# EAGLE design femtoUSB_r1.0.0_TQFP (EAGLE 6.5.0)
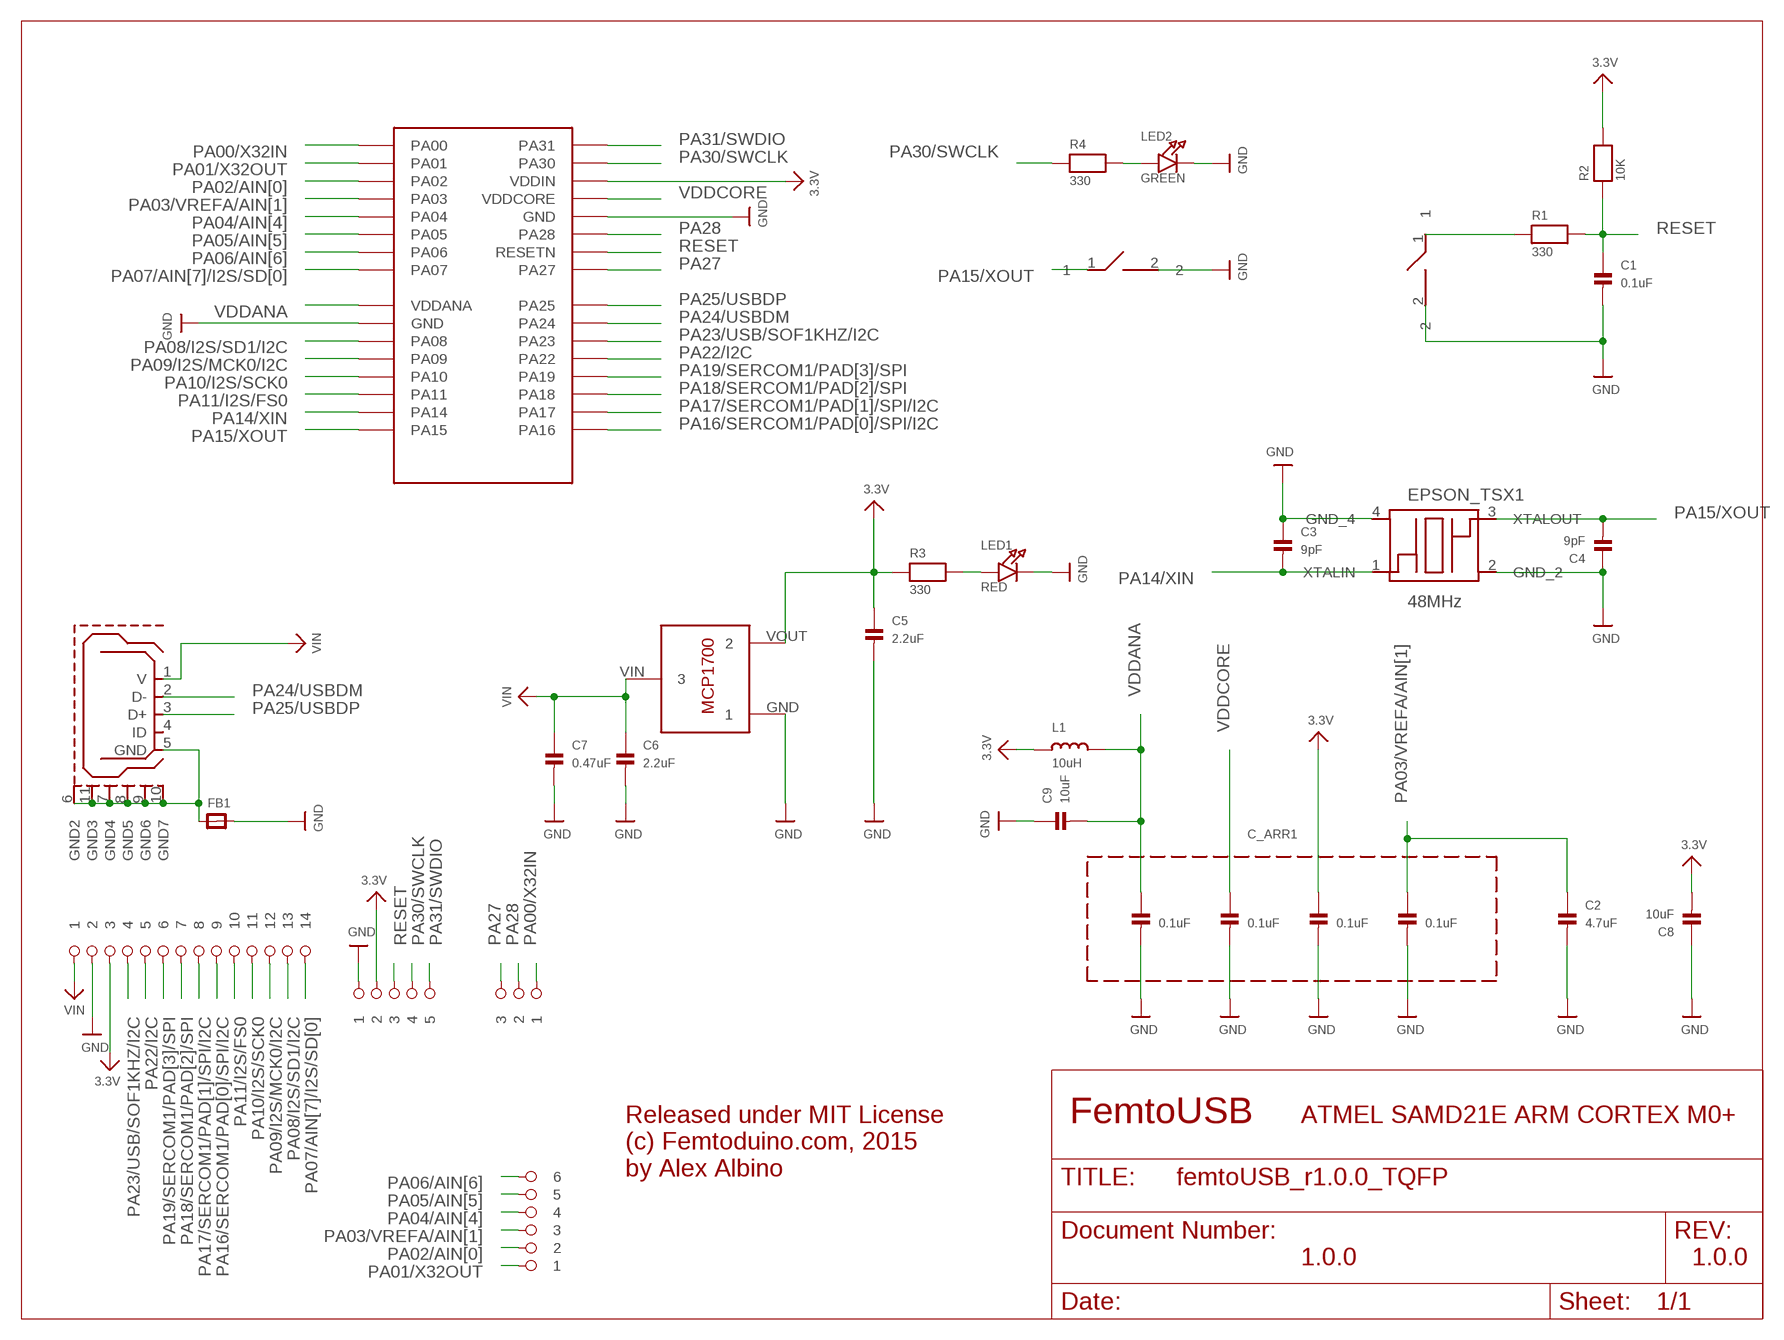
[diagram p0: schematic, sheet 1]

## Parts
BTN  OMRON B3U-300P(M)  SPST_SMD  [SPST_SMD]
C1  0.1uF  CAP_CERAMIC_0402MP  [_0402MP]
C2  4.7uF  CAP_CERAMIC_0402MP  [_0402MP]
C3  9pF  CAP_CERAMIC_0402MP  [_0402MP]
C4  9pF  CAP_CERAMIC_0402MP  [_0402MP]
C5  2.2uF  CAP_CERAMIC_0402MP  [_0402MP]
C6  2.2uF  CAP_CERAMIC_0402MP  [_0402MP]
C7  0.47uF  CAP_CERAMIC_0402MP  [_0402MP]
C8  10uF  CAP_CERAMIC_0402MP  [_0402MP]
C9  10uF  CAP_CERAMIC_0402MP  [_0402MP]
C_ARR1  0.1uF  KEMET_CERAMIC_CAPACITOR_ARRAY_1X4  [CAPACITOR_ARRAY_1206_MONO_1X4]
EPSON_TSX1  48MHz  TSX-3225  [TSX-3225]
FB1  FERRITE_0603MP  [_0603MP]
IC1  ATSAMD21E18A-AU  [32-TQFP]
L1  10uH  INDUCTOR_0603MP  [_0603MP]
LDO_VREG  MCP1700T-3302E/TT  [MCP1700T-3302E/TT]
LED1  RED  LED0603_NOOUTLINE  [CHIPLED_0603_NOOUTLINE]
LED2  GREEN  LED0603_NOOUTLINE  [CHIPLED_0603_NOOUTLINE]
MICRO_B_USB  USB_MICROB  [USB_MICROB_PACKAGE]
R1  330  RESISTOR_0402MP  [_0402MP]
R2  10K  RESISTOR_0402MP  [_0402MP]
R3  330  RESISTOR_0402MP  [_0402MP]
R4  330  RESISTOR_0402MP  [_0402MP]
U$6  1X14_ROUND  [1X14_ROUND]
U$7  1X3_ROUND  [1X3_ROUND]
U$9  1X5_ROUND  [1X5_ROUND]
U$12  1X6_ROUND  [1X6_ROUND]
U$38  SPST_SMD  [SPST_SMD]

## Nets
3.3V: C5.1 C8.2 C_ARR1.5 IC1.30(VDDIN) L1.1 LDO_VREG.VOUT R2.2 R3.1 U$6.P$3 U$9.P$2
GND: BTN.2 C1.2 C2.2 C3.1 C4.1 C5.2 C6.2 C7.2 C8.1 C9.1 C_ARR1.2 C_ARR1.4 C_ARR1.6 C_ARR1.8 EPSON_TSX1.2(GND_2) EPSON_TSX1.4(GND_4) FB1.2 IC1.10(GND) IC1.28(GND) LDO_VREG.GND LED1.C LED2.C U$6.P$2 U$9.P$1 U$38.2
N$1: LED1.A R3.2
N$13: LED2.A R4.2
N$26: BTN.1 R1.1
N$32: FB1.1 MICRO_B_USB.5(GND) MICRO_B_USB.6(GND2) MICRO_B_USB.7(GND4) MICRO_B_USB.8(GND5) MICRO_B_USB.9(GND6) MICRO_B_USB.10(GND7) MICRO_B_USB.11(GND3)
PA00/X32IN: IC1.1(PA00) U$7.P$1
PA01/X32OUT: IC1.2(PA01) U$12.P$1
PA02/AIN[0]: IC1.3(PA02) U$12.P$2
PA03/VREFA/AIN[1]: C2.1 C_ARR1.7 IC1.4(PA03) U$12.P$3
PA04/AIN[4]: IC1.5(PA04) U$12.P$4
PA05/AIN[5]: IC1.6(PA05) U$12.P$5
PA06/AIN[6]: IC1.7(PA06) U$12.P$6
PA07/AIN[7]/I2S/SD[0]: IC1.8(PA07) U$6.P$14
PA08/I2S/SD1/I2C: IC1.11(PA08) U$6.P$13
PA09/I2S/MCK0/I2C: IC1.12(PA09) U$6.P$12
PA10/I2S/SCK0: IC1.13(PA10) U$6.P$11
PA11/I2S/FS0: IC1.14(PA11) U$6.P$10
PA14/XIN: C3.2 EPSON_TSX1.1(XTALIN) IC1.15(PA14)
PA15/XOUT: C4.2 EPSON_TSX1.3(XTALOUT) IC1.16(PA15) U$38.1
PA16/SERCOM1/PAD[0]/SPI/I2C: IC1.17(PA16) U$6.P$9
PA17/SERCOM1/PAD[1]/SPI/I2C: IC1.18(PA17) U$6.P$8
PA18/SERCOM1/PAD[2]/SPI: IC1.19(PA18) U$6.P$7
PA19/SERCOM1/PAD[3]/SPI: IC1.20(PA19) U$6.P$6
PA22/I2C: IC1.21(PA22) U$6.P$5
PA23/USB/SOF1KHZ/I2C: IC1.22(PA23) U$6.P$4
PA24/USBDM: IC1.23(PA24) MICRO_B_USB.2(D-)
PA25/USBDP: IC1.24(PA25) MICRO_B_USB.3(D+)
PA27: IC1.25(PA27) U$7.P$3
PA28: IC1.27(PA28) U$7.P$2
PA30/SWCLK: IC1.31(PA30) R4.1 U$9.P$4
PA31/SWDIO: IC1.32(PA31) U$9.P$5
RESET: C1.1 IC1.26(RESETN) R1.2 R2.1 U$9.P$3
VDDANA: C9.2 C_ARR1.1 IC1.9(VDDANA) L1.2
VDDCORE: C_ARR1.3 IC1.29(VDDCORE)
VIN: C6.1 C7.1 LDO_VREG.VIN MICRO_B_USB.1(V) U$6.P$1
Unconnected: MICRO_B_USB.4(ID)

## Notes on the sheet
- FemtoUSB | ATMEL SAMD21E ARM CORTEX M0+
- Released under MIT License
  (c) Femtoduino.com, 2015
  by Alex Albino
- 1.0.0 | 1.0.0

## Library data of the parts
BTN U$38 = femtoduino:SPST_SMD
C1 = microbuilder:CAP_CERAMIC: Ceramic Capacitors 0402 - 0402 Surface Mount Capacitors 16pF 50V 5% [Digikey: 445-4899-2-ND] 18pF 50V 5% [Digikey: 490-1281-2-ND] 22pF 50V 5% [Digikey: 490-1283-2-ND] 68pF 50V 5% [Digikey: 490-1289-2-ND] 0.1uF 10V 10% [Digikey: 490-1318-2-ND] 1.0uF 6.3V 10% [Digikey: 490-1320-2-ND] 0603 - 0603 Surface Mount Capacitors 16 pF 50V 5% [Digikey: 445-5051-2-ND] 22 pF 50V [Digikey: PCC220ACVTR-ND] 33 pF 50V 5% [Digikey: 490-1415-1-ND] 56pF 50V 5% [Digikey: 490-1421-1-ND] 220pF 50V 5% [Digikey: 445-1285-1-ND] 680 pF 50V 2200 pF 50V 5% C0G [Digikey: 445-1297-1-ND] 5600 pF 100V 5% X7R [Digikey: 478-3711-1-ND] 0.1 µF 25V 10% [Digikey: PCC2277TR-ND] 0.22 µF 16V 10% X7R [Digikey: 445-1318-1-ND] 1.0 µF 25V 10% [Digikey: 445-5146-2-ND] 0603 - RF Specific 3pF 250V +/-0.1pF RF [Digikey: 712-1347-1-ND] 18 pF 250V 5% [Digikey: 478-3505-1-ND or 712-1322-1-ND] 56 pF 250V 5% C0G RF [Digikey: 490-4867-1-ND] 68 pF 250V RF [Digikey: 490-4868-1-ND] 0805 - 0805 Surface Mount Capacitors 220 pF 250V 2% RF Ceramic Capacitor [Digikey: 712-1398-1-ND] 1000 pF 50V 2% NP0 Ceramic Capacitor [Digikey: 478-3760-1-ND] 0.1 µF 25V 10% Ceramic Capacitor [Digikey: PCC1828TR-ND] 1.0 µF 16V 10% Ceramic Capacitor[Digikey: 490-1691-2-ND] 10.0 µF 10V 10% Ceramic Capacitor[Digikey: 709-1228-1-ND] 10.0 uF 16V 10% Ceramic Capacitor [Digikey: 478-5165-2-ND] 47 uF 6.3V 20% Ceramic Capacitor [Digikey: 587-1779-1-ND or 399-5506-1-ND] 1206 - 1206 Surface Mount Capacitors 47uF 10V 20% Ceramic Capacitor [Digikey: 490-5528-1-ND or 399-5508-1-ND or 445-6010-1-ND] 100uF 6.3V -20%, +80% Y5V Ceramic Capacitor (Digikey: 490-4512-1-ND, Mouser: 81-GRM31CF50J107ZE1L); DIGIKEY_PART: 445-4958-1-ND
C2-C9 = microbuilder:CAP_CERAMIC: Ceramic Capacitors 0402 - 0402 Surface Mount Capacitors 16pF 50V 5% [Digikey: 445-4899-2-ND] 18pF 50V 5% [Digikey: 490-1281-2-ND] 22pF 50V 5% [Digikey: 490-1283-2-ND] 68pF 50V 5% [Digikey: 490-1289-2-ND] 0.1uF 10V 10% [Digikey: 490-1318-2-ND] 1.0uF 6.3V 10% [Digikey: 490-1320-2-ND] 0603 - 0603 Surface Mount Capacitors 16 pF 50V 5% [Digikey: 445-5051-2-ND] 22 pF 50V [Digikey: PCC220ACVTR-ND] 33 pF 50V 5% [Digikey: 490-1415-1-ND] 56pF 50V 5% [Digikey: 490-1421-1-ND] 220pF 50V 5% [Digikey: 445-1285-1-ND] 680 pF 50V 2200 pF 50V 5% C0G [Digikey: 445-1297-1-ND] 5600 pF 100V 5% X7R [Digikey: 478-3711-1-ND] 0.1 µF 25V 10% [Digikey: PCC2277TR-ND] 0.22 µF 16V 10% X7R [Digikey: 445-1318-1-ND] 1.0 µF 25V 10% [Digikey: 445-5146-2-ND] 0603 - RF Specific 3pF 250V +/-0.1pF RF [Digikey: 712-1347-1-ND] 18 pF 250V 5% [Digikey: 478-3505-1-ND or 712-1322-1-ND] 56 pF 250V 5% C0G RF [Digikey: 490-4867-1-ND] 68 pF 250V RF [Digikey: 490-4868-1-ND] 0805 - 0805 Surface Mount Capacitors 220 pF 250V 2% RF Ceramic Capacitor [Digikey: 712-1398-1-ND] 1000 pF 50V 2% NP0 Ceramic Capacitor [Digikey: 478-3760-1-ND] 0.1 µF 25V 10% Ceramic Capacitor [Digikey: PCC1828TR-ND] 1.0 µF 16V 10% Ceramic Capacitor[Digikey: 490-1691-2-ND] 10.0 µF 10V 10% Ceramic Capacitor[Digikey: 709-1228-1-ND] 10.0 uF 16V 10% Ceramic Capacitor [Digikey: 478-5165-2-ND] 47 uF 6.3V 20% Ceramic Capacitor [Digikey: 587-1779-1-ND or 399-5506-1-ND] 1206 - 1206 Surface Mount Capacitors 47uF 10V 20% Ceramic Capacitor [Digikey: 490-5528-1-ND or 399-5508-1-ND or 445-6010-1-ND] 100uF 6.3V -20%, +80% Y5V Ceramic Capacitor (Digikey: 490-4512-1-ND, Mouser: 81-GRM31CF50J107ZE1L)
C_ARR1 = array-capacitor:KEMET_CERAMIC_CAPACITOR_ARRAY_1X4
EPSON_TSX1 = crystals:TSX-3225; DIGIKEY_PART: TSX-3225 32.0000MF15X-B-ND
FB1 = microbuilder:FERRITE: Ferrite Bead 0603 MMZ1608B121C - 120 Ohm @ 100MHz, 600mA, 0.15 Ohm DC Resistance - Digikey: 445-2164-1-ND BK1608HW121-T - 120 Ohm, 600mA Ferrite Chip - Digikey: 587-1876-2-ND 0805 HZ0805B272R-10 - 2.7K Ohm @ 100MHz, 200mA, 0.8 Ohm DC Resistance - Digikey: 240-2504-1-ND (see also Murata BLM21BD272SN1L) MMZ2012Y152B - 1.5K Ohm @ 100MHz, 500mA, 0.4 Ohm DC Resistance - Digikey: 445-1560-1-ND - Mainly for high frequency (80-400MHz) MMZ2012R102A - 1K Ohm @ 100MHz, 500mA, 0.3 Ohm DC Resistance - Digikey: 445-1555-2-ND - More general purpose (10-200MHz)
IC1 = atmel-samd21:ATSAMD21E18A-AU; DIGIKEY_PART: ATSAMD21E18A-AU-ND
L1 = microbuilder:INDUCTOR: Inductors 0603: 10nH Ceramic Inductor - microwire antenna/RF (Digikey: 712-1434-2-ND) 0805: 560nH Ceramic Inductor - RF (Digikey: 553-1047-1-ND) 270nH Ceramic Inductor - Q = 40@250MHz, +-5%, 1 Ohm DC Resistance (Digikey: 535-10506-2-ND) 1007 (2518 Metric) SMT: 10µH 10% 250mOhm 820mA 1007 Inductor (Digikey: 587-2189-1-ND) 22µH 10% 500mOhm 580mA 1007 Inductor (Digikey: 587-2190-1-ND) 47µH 10% 950mOhm 420mA 1007 Inductor (Digikey: 587-2191-1-ND) 47µH 5% 100mOhm 1A 1008 Inductor (Digikey: 732-1816-1-ND) 5.0x5.0mm (Taiyo Yuden NR5040 Series) 6.8µH 20% 2.3A 64mOhm Inductor (Digikey: 587-2374-2-ND) 5.0x5.0mm (TDK VLC5045 Series) 4.7µH 20% 3.3A 34mOhm Inductor (Digikey: 445-6526-1-ND) 6.8µH 20% 2.7A 46mOhm Inductor (Digikey: 445-6527-1-ND) 6.0x6.0mm (TDK VLC6045 Series) 4.7µH 20% 3.8A 27mOhm Inductor (Digikey: 445-6538-2-ND) 6.8µH 20% 3A 41mOhm Inductor (Digikey: 445-6540-1-ND) 6.2µH 30% 2.2A 45mOhm Inductor (Digikey: SRR5028-6R2YCT-ND) - Not TDK VLC6045 but footprint should match 6.0x6.0mm (TDK SLF6045 Series) 6.8uH 30% 2A 33mOhm Inductor (Digikey: 445-4572-1-ND, Mouser: 810-SLF645T6R8N2R0PF)
LDO_VREG = MCP1700T-3302E_TT:MCP1700T-3302E/TT: Microchip LDO "MCP1700" in a 3-Pin SOT-23 package. ID: MCP1700T-3302E/TT
LED1 LED2 = microbuilder:LED: LED 0603 - 0603 Surface Mount Package 2mA: Green LED - Low Power (3.9mcd, 2ma, 1.7Vf) - Digikey: 475-2709-2-ND Orange LED - Low Power (9.8mcd, 2ma, 1.8Vf) - Digikey: 475-1194-2-ND Red LED - Low Power (5mcd, 2ma, 1.8Vf) - Digikey: 475-1195-2-ND Yellow LED - Low Power (7mcd, 2ma, 1.8Vf) - Digikey: 475-1196-2-ND 5mA: Blue LED - Low Power (17mcd, 5ma, 2.9Vf) - Digikey: LNJ937W8CRACT-ND 0805 - 0805 Surface Mount Package 2mA: Red LED (8.8mcd, 2mA, 1.8Vf, Clear) - Low Power [Digikey: 475-2510-1-ND] Green LED (5mcd, 2mA, 1.8Vf, Clear) - Low Power [Digikey: 475-2730-1-ND] Yellow LED (11.3mcd, 2mA, 1.8Vf, Clear) - Low Power [Digikey: 475-2555-1-ND] 20mA: Red LED (104mcd, 20mA, Diffused) - LS R976 [Digikey: 475-1278-6-ND] Red LED (12mcd, 20mA, 2.0Vf, Clear) - APT2012EC [Digikey: 754-1128-1-ND] Green LED (15mcd, 20mA, 2.2Vf, Clear) - APT2012GC [Digikey: 754-1131-1-ND] Orange LED (160mcd, 20mA, 2.1Vf, Clear) - APT2012SECK [Digikey: 754-1130-1-ND] 1206 - 1206 Surface Mount Package Green LED (26mcd, 20mA, Diffused) - LG N971 [Digikey: 475-1407-6-ND] Red LED (15mcd, 20mA, Diffused) - LH N974 [Digikey: 475-1416-6-ND]
MICRO_B_USB = femtoduino:USB_MICROB: This is the hirose ZX62-B-5PA(11) MICRO-USB B Type female connection.
R1 = microbuilder:RESISTOR: Resistors 0402 - 0402 Surface Mount Package 22 Ohm 1% 1/16W [Digikey: 311-22.0LRTR-ND] 33 Ohm 5% 1/16W 1.0K 5% 1/16W 1.5K 5% 1/16W 2.0K 1% 1/16W 10.0K 1% 1/16W [Digikey: 311-10.0KLRTR-ND] 10.0K 5% 1/16W [Digikey: RMCF0402JT10K0TR-ND] 12.1K 1% 1/16W [Digikey: 311-22.0LRTR-ND] 100.0K 5% 1/16W 0603 - 0603 Surface Mount Package 0 Ohm 1/10 Watt 1% Resistor 15 Ohm 1/10 Watt 1% Resistor 33 Ohm 1/10 Watt 1% Resistor 49.9 Ohm 1/10 Watt 1% Resistor 100 Ohm 1/10 Watt 1% Resistor 150 Ohm 1/10 Watt 1% Resistor 240 Ohm 1/10 Watt 1% Resistor 390 Ohm 1/10 Watt 1% Resistor 560 Ohm 1/10 Watt 1% Resistor 680 Ohm 1/10 Watt 1% Resistor 750 Ohm 1/10 Watt 1% Resistor 1.0K Ohm 1/10 Watt 1% Resistor 1.5K Ohm 1/10 Watt 1% Resistor 2.0K Ohm 1/10 Watt 1% Resistor 2.2K Ohm 1/10 Watt 1% Resistor 3.3K Ohm 1/10 Watt 1% Resistor 4.7K Ohm 1/10 Watt 1% Resistor 10.0K Ohm 1/10 Watt 1% Resistor 12.0K Ohm 1/10 Watt 1% Resistor 12.1K Ohm 1/10 Watt 1% Resistor 20.0K Ohm 1/10 Watt 1% Resistor 33.0K Ohm 1/10 Watt 1% Resistor 100.0K Ohm 1/10 Watt 1% Resistor 0805 - 0805 Surface Mount Package 0 Ohm 1/8 Watt 1% Resistor 33 Ohm 1/8 Watt 1% Resistor 100 Ohm 1/8 Watt 1% Resistor 150 Ohm 1/8 Watt 1% Resistor 200 Ohm 1/8 Watt 1% Resistor 240 Ohm 1/8 Watt 1% Resistor 330 Ohm 1/8 Watt 1% Resistor 390 Ohm 1/8 Watt 1% Resistor 470 Ohm 1/8 Watt 1% Resistor 1.0K Ohm 1/8 Watt 1% Resistor 1.5K Ohm 1/8 Watt 1% Resistor 2.0K Ohm 1/8 Watt 1% Resistor 4.7K Ohm 1/8 Watt 1% Resistor 5.1K Ohm 1/8 Watt 1% Resistor 5.6K Ohm 1/8 Watt 1% Resistor 10.0K Ohm 1/8 Watt 1% Resistor 22.0K Ohm 1/8 Watt 1% Resistor 33.0K Ohm 1/8 Watt 1% Resistor 100K Ohm 1/8 Watt 1% Resistor 1206 - 1206 Surface Mount Package 2012 - 2010 Surface Mount Package 0.11 Ohm 1/2 Watt 1% Resistor - Digikey: RHM.11UCT-ND; DIGIKEY_PART: 541-330JCT-ND
R2-R4 = microbuilder:RESISTOR: Resistors 0402 - 0402 Surface Mount Package 22 Ohm 1% 1/16W [Digikey: 311-22.0LRTR-ND] 33 Ohm 5% 1/16W 1.0K 5% 1/16W 1.5K 5% 1/16W 2.0K 1% 1/16W 10.0K 1% 1/16W [Digikey: 311-10.0KLRTR-ND] 10.0K 5% 1/16W [Digikey: RMCF0402JT10K0TR-ND] 12.1K 1% 1/16W [Digikey: 311-22.0LRTR-ND] 100.0K 5% 1/16W 0603 - 0603 Surface Mount Package 0 Ohm 1/10 Watt 1% Resistor 15 Ohm 1/10 Watt 1% Resistor 33 Ohm 1/10 Watt 1% Resistor 49.9 Ohm 1/10 Watt 1% Resistor 100 Ohm 1/10 Watt 1% Resistor 150 Ohm 1/10 Watt 1% Resistor 240 Ohm 1/10 Watt 1% Resistor 390 Ohm 1/10 Watt 1% Resistor 560 Ohm 1/10 Watt 1% Resistor 680 Ohm 1/10 Watt 1% Resistor 750 Ohm 1/10 Watt 1% Resistor 1.0K Ohm 1/10 Watt 1% Resistor 1.5K Ohm 1/10 Watt 1% Resistor 2.0K Ohm 1/10 Watt 1% Resistor 2.2K Ohm 1/10 Watt 1% Resistor 3.3K Ohm 1/10 Watt 1% Resistor 4.7K Ohm 1/10 Watt 1% Resistor 10.0K Ohm 1/10 Watt 1% Resistor 12.0K Ohm 1/10 Watt 1% Resistor 12.1K Ohm 1/10 Watt 1% Resistor 20.0K Ohm 1/10 Watt 1% Resistor 33.0K Ohm 1/10 Watt 1% Resistor 100.0K Ohm 1/10 Watt 1% Resistor 0805 - 0805 Surface Mount Package 0 Ohm 1/8 Watt 1% Resistor 33 Ohm 1/8 Watt 1% Resistor 100 Ohm 1/8 Watt 1% Resistor 150 Ohm 1/8 Watt 1% Resistor 200 Ohm 1/8 Watt 1% Resistor 240 Ohm 1/8 Watt 1% Resistor 330 Ohm 1/8 Watt 1% Resistor 390 Ohm 1/8 Watt 1% Resistor 470 Ohm 1/8 Watt 1% Resistor 1.0K Ohm 1/8 Watt 1% Resistor 1.5K Ohm 1/8 Watt 1% Resistor 2.0K Ohm 1/8 Watt 1% Resistor 4.7K Ohm 1/8 Watt 1% Resistor 5.1K Ohm 1/8 Watt 1% Resistor 5.6K Ohm 1/8 Watt 1% Resistor 10.0K Ohm 1/8 Watt 1% Resistor 22.0K Ohm 1/8 Watt 1% Resistor 33.0K Ohm 1/8 Watt 1% Resistor 100K Ohm 1/8 Watt 1% Resistor 1206 - 1206 Surface Mount Package 2012 - 2010 Surface Mount Package 0.11 Ohm 1/2 Watt 1% Resistor - Digikey: RHM.11UCT-ND
U$6 = pins_1.27mm_pitch:1X14_ROUND
U$7 = pins_1.27mm_pitch:1X3_ROUND
U$9 = pins_1.27mm_pitch:1X5_ROUND
U$12 = pins_1.27mm_pitch:1X6_ROUND

## Board
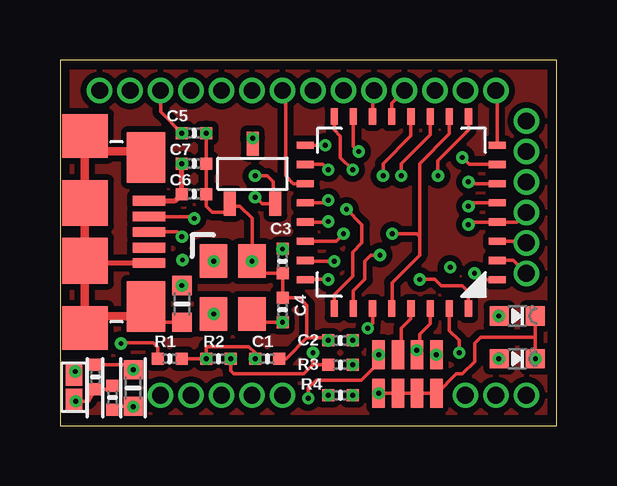
[diagram p1: board, top side]
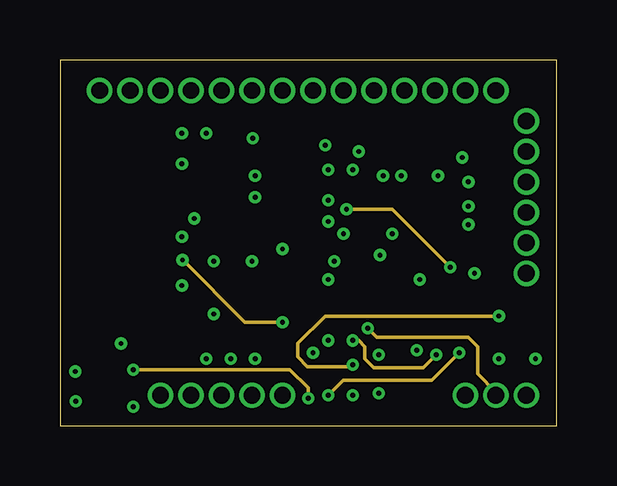
[diagram p2: board, inner layer Route2]
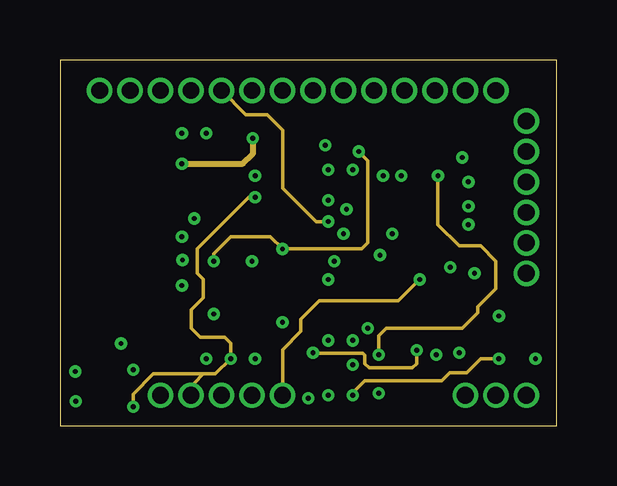
[diagram p3: board, inner layer Route15]
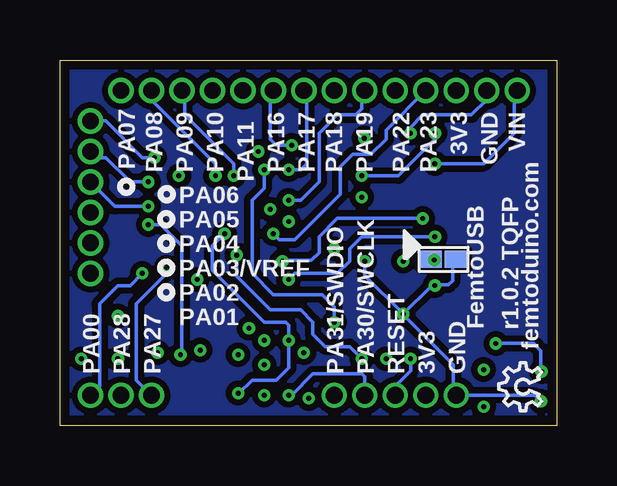
[diagram p4: board, bottom side, seen from below]

Size 20.7 x 15.24 mm. Coordinates in mm from the lower left corner, seen from the top.
Outline: 0,0 20.7,0 20.7,15.24 0,15.24 0,0
Copper layers (1+2*15+16): Top 0.035mm / dielectric 0.7mm / Route2 0.035mm / dielectric 0.15mm / Route15 0.035mm / dielectric 0.2mm / Bottom 0.035mm
Design rules "AQS_custom_4layer": minimum track width 5mil, minimum drill 5mil, track to track 6mil, track to pad 6mil, pad to pad 6mil, via to via 6mil, smd to smd 1mil, copper to edge 15mil, drill to drill 6mil, minimum pad ring 7mil, minimum via ring 3mil, stop-mask expansion 2mil, vias tented up to drill 10mil, thermal gap 10mil

### Footprints (pad centres in the part's own frame; a part is rotated, then mirrored left to right if it is on the bottom)
SPST_SMD = smd 0.889 x 0.699: 1 -0.508,0; 2 0.508,0
_0402MP = smd 0.5 x 0.5: 1 -0.508,0; 2 0.508,0
CAPACITOR_ARRAY_1206_MONO_1X4 = smd 0.52 x 1.2: 1 -1.2,0.8; 2 -1.2,-0.8; 3 -0.4,0.8; 4 -0.4,-0.8; 5 0.4,0.8; 6 0.4,-0.8; 7 1.2,0.8; 8 1.2,-0.8
TSX-3225 = smd 1.4 x 1.15: 1 0,-1.6; 2 2.2,-1.6; 3 2.2,0; 4 0,0
_0603MP = smd 0.8 x 0.8: 1 -0.762,0; 2 0.762,0
32-TQFP = smd 0.7 x 0.3: 1 -4,2.8; 2 -4,2; 3 -4,1.2; 4 -4,0.4; 5 -4,-0.4; 6 -4,-1.2; 7 -4,-2; 8 -4,-2.8; 17 4,-2.8; 18 4,-2; 19 4,-1.2; 20 4,-0.4; 21 4,0.4; 22 4,1.2; 23 4,2; 24 4,2.8 | smd 0.3 x 0.7: 9 -2.8,-4; 10 -2,-4; 11 -1.2,-4; 12 -0.4,-4; 13 0.4,-4; 14 1.2,-4; 15 2,-4; 16 2.8,-4; 25 2.8,4; 26 2,4; 27 1.2,4; 28 0.4,4; 29 -0.4,4; 30 -1.2,4; 31 -2,4; 32 -2.8,4
MCP1700T-3302E/TT = smd 0.5 x 1: GND 0.5,-0.6; VIN 1.45,1.9; VOUT 2.4,-0.6
CHIPLED_0603_NOOUTLINE = smd 0.8 x 0.8: A 0,-0.75; C 0,0.75
USB_MICROB_PACKAGE = smd 0.4 x 1.35: 1 -1.3,-0.68; 2 -0.64,-0.68; 3 0,-0.68; 4 0.66,-0.68; 5 1.3,-0.68 | smd 2.1 x 1.6: 6 -3.1,-0.8; 11 3.1,-0.8 | smd 1.8 x 1.9: 7 -4,-3.35; 10 4,-3.35 | smd 1.9 x 1.9: 8 -1.2,-3.35; 9 1.2,-3.35
1X14_ROUND = drill 0.7 pad 1: P$1 0,0; P$2 0,-1.27; P$3 0,-2.54; P$4 0,-3.81; P$5 0,-5.08; P$6 0,-6.35; P$7 0,-7.62; P$8 0,-8.89; P$9 0,-10.16; P$10 0,-11.43; P$11 0,-12.7; P$12 0,-13.97; P$13 0,-15.24; P$14 0,-16.51
1X3_ROUND = drill 0.7 pad 1: P$1 0,0; P$2 0,-1.27; P$3 0,-2.54
1X5_ROUND = drill 0.7 pad 1: P$1 0,0; P$2 0,-1.27; P$3 0,-2.54; P$4 0,-3.81; P$5 0,-5.08
1X6_ROUND = drill 0.7 pad 1: P$1 0,0; P$2 0,-1.27; P$3 0,-2.54; P$4 0,-3.81; P$5 0,-5.08; P$6 0,-6.35

### Placement (x,y rotation side)
BTN  0.58,1.6 270 top
C1  8.64,2.79 0 top
C2  11.68,3.56 180 top
C3  9.27,6.86 90 top
C4  9.27,4.83 270 top
C5  5.59,12.19 0 top
C6  5.59,9.65 0 top
C7  5.59,10.92 0 top
C8  2.18,1.17 270 top
C9  1.47,2.03 90 top
C_ARR1  14.48,2.16 0 top
EPSON_TSX1  8,6.86 270 top
FB1  5.08,5.08 90 top
IC1  14.22,8.89 180 top
L1  3.05,1.57 90 top
LDO_VREG  6.58,9.86 0 top
LED1  19.05,4.57 270 top
LED2  19.05,2.79 270 top
MICRO_B_USB  4.39,8.08 270 top
R1  4.57,2.79 0 top
R2  6.6,2.79 0 top
R3  11.68,2.54 0 top
R4  11.68,1.27 0 top
U$6  1.65,13.97 90 top
U$7  19.43,1.27 270 top
U$9  4.19,1.27 90 top
U$12  19.43,6.35 180 top
U$35  [OSHW_6X70_NOTEXT]  0.64,0.64 90 bottom
U$38  4.72,6.93 0 bottom

### Tracks (layer width: path | path; a pad name or v marks a point on that pad's centre or on a via)
3.3V  (via drill 0.2 pad 0.51)
  Top 0.152: U$6.P$3 4.19,13.08 C5.1 | v8.13,10.41 8.64,10.41 8.89,10.16 8.89,9.25 LDO_VREG.VOUT 8.43,9.26 v8.13,9.53 | R3.1 10.54,2.54 | 10.54,2.54 10.16,2.16 7.24,2.16 7.11,2.29 R2.2 | C8.2 2.31,0.81 L1.1 v3.05,0.79 3.05,0.66 | IC1.30 15.42,4.25 14.99,3.81 14.99,3.19 14.88,3.09 C_ARR1.5 14.86,2.98 v14.86,3.15 | 10.54,2.54 v10.54,3.05
  Route15 0.152: 5.97,2.16 6.48,2.16 R2.2 7.11,3.43 6.86,3.68 5.84,3.68 5.46,4.06 5.46,4.83 5.97,5.33 5.97,6.1 5.71,6.35 5.71,7.37 7.87,9.53 v8.13,9.53 | 5.97,2.16 5.59,1.78 5.59,1.4 U$9.P$2 | v3.05,0.79 3.05,1.32 3.89,2.16 5.97,2.16 | v14.86,3.15 14.86,2.59 14.68,2.41 12.88,2.41 12.7,2.59 12.7,2.95 12.62,3.02 10.59,3.02 v10.54,3.05
  Bottom 0.152: C5.1 5.08,11.94 6.6,10.41 v8.13,10.41
  other vias: 7.11,2.79 5.08,12.19
GND  (via drill 0.2 pad 0.51)
  Top 0.152: IC1.10 16.22,12.16 14.99,10.92 14.99,7.87 | C1.2 9.42,2.79 10.29,3.66 | 10.29,3.66 10.29,5.03 9.98,5.33 C4.1 C3.1 8.51,6.35 EPSON_TSX1.4 8,8.64 7.49,9.14 7.09,9.14 LDO_VREG.GND 7.05,8.89 6.35,8.89 6.1,9.14 C6.2 C7.2 C5.2 | LED1.C 19.8,3.68 | 19.8,3.68 LED2.C v19.81,2.79 19.8,2.55 | 14.99,7.87 14.99,7.11 13.84,5.97 13.84,4.91 IC1.28 | v13.84,8 14.86,8 14.99,7.87 | C_ARR1.2 C_ARR1.4 C_ARR1.6 C_ARR1.8 15.71,1.36 16.51,2.16 16.76,2.16 17.27,2.67 17.27,3.43 17.53,3.68 19.8,3.68 | BTN.2 v0.66,1.02 1.17,1.02 C9.1 2.13,1.52 C8.1 | 10.29,3.66 11.18,3.66 C2.2
  Bottom 0.152: v0.66,1.02 0.91,1.27 U$9.P$1 4.32,1.4 4.32,2.54 6.4,4.62 EPSON_TSX1.2 | U$6.P$2 2.92,13.59 3.56,12.95 5.59,12.95 6.1,12.45 C5.2 | EPSON_TSX1.4 8,6.26 EPSON_TSX1.2 | EPSON_TSX1.2 5.22,5.84 FB1.2 5.05,5.87 4.52,5.87 4.34,6.04 4.34,6.81 U$38.2 | C_ARR1.2 13.25,1.36 12.7,1.91 11.68,1.91 11.18,2.41 C2.2 11.18,4.19 11.3,4.32 12.19,4.32 14.35,6.48 14.35,7.49 v13.84,8
  other vias: 6.4,4.66 5.08,5.84 6.1,12.19 8,6.86 11.18,3.56 13.28,1.36
N$1  (via drill 0.2 pad 0.51)
  Top 0.152: LED1.A v18.29,4.57
  Route2 0.152: v18.29,4.57 11.05,4.57 9.91,3.43 9.91,2.87 10.31,2.46 12.12,2.46 R3.2
  other vias: 12.19,2.54
N$2
  pour Top (isolate 0.254): 0.25,14.99 20.32,14.99 20.32,0.51 0.25,0.51
  pour Bottom (isolate 0.254): 0.25,14.99 20.32,14.99 20.32,0.51 0.25,0.51
N$13  (via drill 0.2 pad 0.51)
  Top 0.152: LED2.A v18.29,2.79
  Route15 0.152: R4.2 12.19,1.37 12.7,1.88 15.9,1.88 16.23,2.21 16.94,2.21 17.53,2.79 v18.29,2.79
  other vias: 12.19,1.27
N$26  (via drill 0.2 pad 0.51)
  Top 0.152: R1.1 4.06,3.28 3.89,3.45 2.56,3.45 v2.54,3.43 | BTN.1 v0.64,2.26
  Bottom 0.152: v2.54,3.43 0.96,3.43 0.66,3.12 0.66,2.34 v0.64,2.26
N$32
  Top 0.152: FB1.1 4.25,4.32 MICRO_B_USB.11
  Top 0.203: MICRO_B_USB.5 1.04,6.78 MICRO_B_USB.9
  Top 0.356: MICRO_B_USB.7 1.04,11.43 | 1.04,11.43 MICRO_B_USB.8 MICRO_B_USB.9 1.04,4.57 | 1.04,4.57 MICRO_B_USB.10 | MICRO_B_USB.11 3.59,4.57 1.04,4.57 | MICRO_B_USB.6 3.59,11.43 1.04,11.43
PA00/X32IN  (via drill 0.2 pad 0.51)
  Top 0.152: IC1.1 17.53,6.09 v17.27,6.35
  Bottom 0.152: v17.27,6.35 17.78,5.84 18.29,5.84 19.05,5.08 19.05,1.65 U$7.P$1
PA01/X32OUT
  Top 0.152: IC1.2 18.89,6.89 U$12.P$1
PA02/AIN[0]
  Top 0.152: IC1.3 19.36,7.69 U$12.P$2
PA03/VREFA/AIN[1]  (via drill 0.2 pad 0.51)
  Top 0.152: U$12.P$3 19.03,8.49 IC1.4 17.13,8.49 v17.02,8.38
  Route2 0.152: C2.1 12.45,3.56 12.7,3.3 12.7,2.79 13.08,2.41 15.13,2.41 C_ARR1.7
  Bottom 0.152: v17.02,8.38 16.51,8.38 15.62,7.49 15.62,3.02 C_ARR1.7
  other vias: 15.68,2.96 12.19,3.56
PA04/AIN[4]  (via drill 0.2 pad 0.51)
  Top 0.152: IC1.5 17.16,9.29 v17.02,9.14
  Bottom 0.152: v17.02,9.14 18.41,9.14 U$12.P$4
PA05/AIN[5]  (via drill 0.2 pad 0.51)
  Top 0.152: IC1.6 17.09,10.09 v17.02,10.16
  Bottom 0.152: v17.02,10.16 17.78,10.16 18.8,11.18 19.18,11.18 U$12.P$5
PA06/AIN[6]  (via drill 0.2 pad 0.51)
  Top 0.152: IC1.7 17.05,10.89 v16.76,11.18
  Bottom 0.152: v16.76,11.18 17.27,11.18 18.8,12.7 U$12.P$6
PA07/AIN[7]/I2S/SD[0]
  Top 0.152: IC1.8 18.22,13.97 U$6.P$14
PA08/I2S/SD1/I2C  (via drill 0.2 pad 0.51)
  Top 0.152: IC1.11 15.42,12.12 14.22,10.92 v14.22,10.41
  Bottom 0.152: v14.22,10.41 14.22,10.92 16.76,13.46 16.76,13.84 U$6.P$13
PA09/I2S/MCK0/I2C  (via drill 0.2 pad 0.51)
  Top 0.152: IC1.12 14.62,12.08 13.46,10.92 v13.46,10.41
  Bottom 0.152: v13.46,10.41 13.46,10.92 15.49,12.95 15.49,13.84 U$6.P$12
PA10/I2S/SCK0
  Top 0.152: IC1.13 13.82,13.44 U$6.P$11
PA11/I2S/FS0
  Top 0.152: IC1.14 13.02,13.91 U$6.P$10
PA14/XIN  (via drill 0.2 pad 0.51)
  Top 0.152: IC1.15 12.22,11.65 v12.45,11.43
  Route15 0.152: EPSON_TSX1.1 6.4,7.16 7.11,7.87 8.76,7.87 C3.2 12.57,7.37 12.83,7.62 12.83,11.05 v12.45,11.43
  other vias: 6.4,6.86 9.27,7.37
PA15/XOUT  (via drill 0.2 pad 0.51)
  Top 0.152: IC1.16 11.42,12.32 11.68,12.06 11.68,11.18 v12.19,10.67 | C4.2 8.34,4.32 EPSON_TSX1.3
  Route2 0.152: v5.11,6.91 7.7,4.32 C4.2
  Bottom 0.152: C4.2 9.27,4.95 9.78,5.46 11.81,5.46 12.7,6.35 12.7,9.4 12.19,9.91 v12.19,10.67 | U$38.1 5.21,6.91 v5.11,6.91
  other vias: 9.27,4.32
PA16/SERCOM1/PAD[0]/SPI/I2C  (via drill 0.2 pad 0.51)
  Top 0.152: IC1.17 v11.04,11.69 v11.05,11.68
  Bottom 0.152: v11.05,11.68 11.68,11.68 11.94,11.94 11.94,13.84 U$6.P$9
PA17/SERCOM1/PAD[1]/SPI/I2C  (via drill 0.2 pad 0.51)
  Top 0.152: IC1.18 10.95,10.89 v11.18,10.67
  Bottom 0.152: v11.18,10.67 10.67,10.67 10.41,10.92 10.41,13.84 U$6.P$8
PA18/SERCOM1/PAD[2]/SPI
  Top 0.152: IC1.19 9.72,10.09 9.4,10.41 9.4,13.84 U$6.P$7
PA19/SERCOM1/PAD[3]/SPI  (via drill 0.2 pad 0.51)
  Top 0.152: IC1.20 11.07,9.29 v11.18,9.4
  Bottom 0.152: v11.18,9.4 10.67,9.4 9.91,10.16 9.91,12.19 9.14,12.95 8.38,12.95 8.13,13.21 8.13,13.84 U$6.P$6
PA22/I2C  (via drill 0.2 pad 0.51)
  Top 0.152: IC1.21 11.16,8.49 v11.18,8.51
  Route15 0.152: v11.18,8.51 10.67,8.51 9.27,9.91 9.27,12.32 8.64,12.95 7.75,12.95 U$6.P$5
PA23/USB/SOF1KHZ/I2C  (via drill 0.2 pad 0.51)
  Top 0.152: IC1.22 11.5,7.69 v11.81,8
  Bottom 0.152: v11.81,8 11.56,7.75 10.92,7.75 9.02,9.65 9.02,10.79 8.51,11.3 7.75,11.3 7.11,11.94 7.11,12.32 U$6.P$4
PA24/USBDM  (via drill 0.2 pad 0.51)
  Top 0.152: MICRO_B_USB.2 5.51,8.72 v5.59,8.64 | v11.43,6.86 10.26,6.86 IC1.23
  Bottom 0.152: v5.59,8.64 9.14,8.64 9.91,7.87 9.91,7.21 IC1.23 11.65,6.89 v11.43,6.86
PA25/USBDP  (via drill 0.2 pad 0.51)
  Top 0.152: MICRO_B_USB.3 4.88,8.08 v5.08,7.87 | v11.18,6.1 IC1.24
  Bottom 0.152: v5.08,7.87 8.13,7.87 8.64,7.37 8.64,6.86 9.14,6.35 10.92,6.35 v11.18,6.1
PA27  (via drill 0.2 pad 0.51)
  Top 0.152: IC1.25 11.42,5.46 12.19,6.22 12.19,7.24 12.57,7.62 12.57,8.38 v11.94,9.02
  Route2 0.152: v11.94,9.02 13.84,9.02 v16.26,6.6
  Bottom 0.152: v16.26,6.6 16.26,6.35 17.53,5.08 17.53,1.91 U$7.P$3
PA28  (via drill 0.2 pad 0.51)
  Top 0.152: IC1.27 13.02,4.26 v12.83,4.06
  Route2 0.152: U$7.P$2 18.16,1.4 17.4,2.16 17.4,3.3 17.02,3.68 13.21,3.68 v12.83,4.06
PA30/SWCLK  (via drill 0.2 pad 0.51)
  Top 0.152: IC1.31 16.22,3.97 16.64,3.56 v16.64,3.05
  Route2 0.152: v16.64,3.05 15.49,1.91 11.81,1.91 R4.1
  Bottom 0.152: R4.1 11.05,1.27 10.16,2.16 8.13,2.16 8,2.03 U$9.P$4
  other vias: 11.18,1.27
PA31/SWDIO  (via drill 0.2 pad 0.51)
  Top 0.152: v14.99,6.1 15.62,6.1 15.88,5.84 16.76,5.84 17.02,5.59 IC1.32
  Route15 0.152: U$9.P$5 9.27,3.17 10.03,3.94 10.03,4.45 10.79,5.21 14.1,5.21 v14.99,6.1
RESET  (via drill 0.2 pad 0.51)
  Top 0.152: R1.2 R2.1 6.1,3.3 7.87,3.3 8.13,3.05 C1.1 | IC1.26 12.22,5.62 12.7,6.1 12.7,6.86 12.95,7.11 v13.34,7.11
  Bottom 0.152: R2.1 6.1,2.29 6.73,1.65 U$9.P$3 | v13.34,7.11 13.34,6.22 11.94,4.83 10.67,4.83 10.16,4.32 10.16,3.81 9.65,3.3 8.64,3.3 C1.1
  other vias: 6.1,2.79 8.13,2.79
VDDANA  (via drill 0.2 pad 0.51)
  Top 0.152: IC1.9 17.02,12.32 15.75,11.05 v15.75,10.41 | C9.2 2.85,2.54 L1.2 | v10.34,1.14 10.34,1.57 10.67,1.91 12.55,1.91 13.28,2.63 C_ARR1.1
  Route2 0.152: L1.2 9.58,2.34 10.34,1.57 v10.34,1.14
  Route15 0.152: v15.75,10.41 15.75,8.38 16.64,7.49 17.53,7.49 18.16,6.86 18.16,5.71 17.4,4.95 17.4,4.7 16.76,4.06 13.59,4.06 13.28,3.75 C_ARR1.1
  other vias: 13.28,2.96 3.05,2.34
VDDCORE
  Top 0.152: IC1.29 14.62,4.46 14.22,4.06 14.22,3.23 C_ARR1.3
VIN  (via drill 0.2 pad 0.51)
  Top 0.152: LDO_VREG.VIN v8.03,11.98
  Top 0.203: MICRO_B_USB.1 4.8,9.38 C6.1 C7.1
  Route15 0.254: C7.1 7.62,10.92 8.03,11.32 v8.03,11.98
  Bottom 0.152: C7.1 3.05,10.92 1.78,12.19 1.78,13.84 U$6.P$1
  other vias: 5.08,10.92

### Text on the board
bNames: VIN | GND | 3V3 | PA23 | PA22 | PA19 | PA18 | PA17 | PA16 | PA11 | PA10 | PA09 | PA08 | PA07 | PA06 | PA05 | PA04 | PA03/VREF | PA02 | r1.0.2 TQFP | FemtoUSB | PA01 | femtoduino.com | GND | 3V3 | RESET | PA30/SWCLK | PA31/SWDIO | PA27 | PA28 | PA00